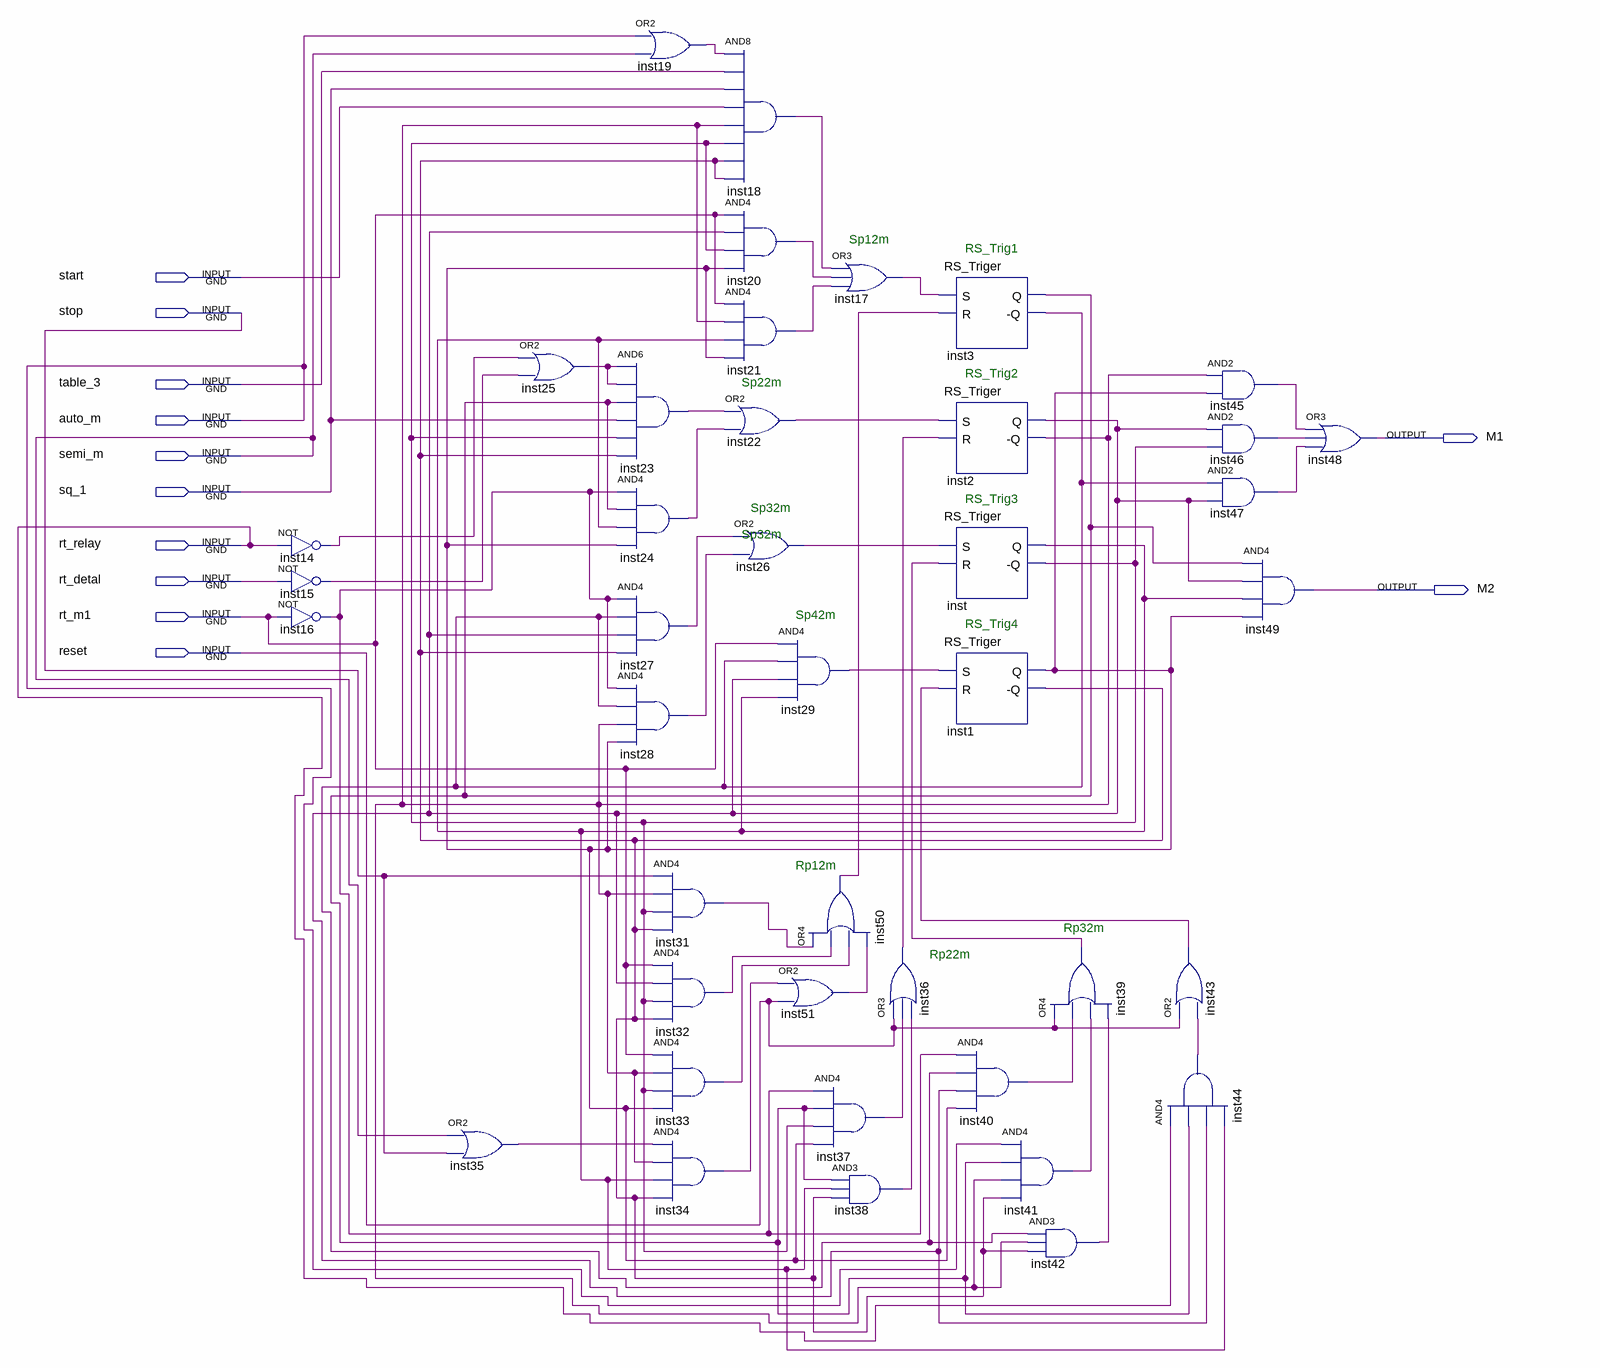
[diagram p0: schematic sheet]
// Quartus schematic auto_table_3.bdf as structural Verilog: 41 symbols, 12 pins
module auto_table_3 (
  input  start,
  input  stop,
  input  table_3,
  input  auto_m,
  input  semi_m,
  input  sq_1,
  input  rt_relay,
  input  rt_detal,
  input  rt_m1,
  input  reset,
  output M1,
  output M2
);

  wire inst1__q, inst1_q, inst2__q, inst2_q, inst3__q, inst3_q, inst14_out, inst15_out, inst16_out,
       inst17_out, inst18_out, inst19_out, inst20_out, inst21_out, inst22_out, inst23_out, inst24_out,
       inst25_out, inst26_out, inst27_out, inst28_out, inst29_out, inst31_out, inst32_out, inst33_out,
       inst34_out, inst35_out, inst36_out, inst37_out, inst38_out, inst39_out, inst40_out, inst41_out,
       inst42_out, inst43_out, inst44_out, inst45_out, inst46_out, inst47_out, inst50_out, inst51_out,
       inst__q, inst_q;

  not inst14 (inst14_out, rt_relay);
  not inst15 (inst15_out, rt_detal);
  not inst16 (inst16_out, rt_m1);
  or inst35 (inst35_out, semi_m, stop);
  or inst25 (inst25_out, inst14_out, inst15_out);
  or inst19 (inst19_out, auto_m, semi_m);
  and inst23 (inst23_out, inst25_out, inst25_out, inst3_q, sq_1, inst__q, inst1__q);
  and inst24 (inst24_out, inst16_out, inst3_q, inst_q, inst1_q);
  and inst27 (inst27_out, inst16_out, inst3__q, inst2_q, inst1__q);
  and inst28 (inst28_out, inst16_out, inst3__q, inst2__q, inst1_q);
  and inst31 (inst31_out, stop, inst2__q, inst__q, inst1__q);
  and inst32 (inst32_out, rt_m1, inst2_q, inst__q, inst1__q);
  and inst33 (inst33_out, rt_m1, inst2__q, inst__q, inst1_q);
  and inst34 (inst34_out, inst35_out, inst2__q, inst_q, inst1__q);
  and inst18 (inst18_out, inst19_out, table_3, sq_1, start, inst2__q, inst__q, inst1__q, inst1__q);
  and inst20 (inst20_out, rt_m1, inst2_q, inst__q, inst1_q);
  and inst21 (inst21_out, rt_m1, inst2__q, inst_q, inst1_q);
  or inst22 (inst22_out, inst23_out, inst24_out);
  or inst26 (inst26_out, inst27_out, inst28_out);
  and inst29 (inst29_out, rt_m1, inst3__q, inst2_q, inst_q);
  or inst50 (inst50_out, inst31_out, inst32_out, inst33_out, inst51_out);
  or inst51 (inst51_out, inst34_out, reset);
  and inst37 (inst37_out, inst16_out, inst3_q, inst__q, inst1_q);
  or inst17 (inst17_out, inst18_out, inst20_out, inst21_out);
  or inst36 (inst36_out, reset, inst37_out, inst38_out);
  and inst38 (inst38_out, inst3_q, inst_q, inst1__q);
  RS_Triger inst3 (.S(inst17_out), .R(inst50_out), .Q(inst3_q), .\-Q (inst3__q));
  RS_Triger inst2 (.S(inst22_out), .R(inst36_out), .Q(inst2_q), .\-Q (inst2__q));
  RS_Triger inst (.S(inst26_out), .R(inst39_out), .Q(inst_q), .\-Q (inst__q));
  RS_Triger inst1 (.S(inst29_out), .R(inst43_out), .Q(inst1_q), .\-Q (inst1__q));
  and inst40 (inst40_out, inst16_out, inst3__q, inst2_q, inst1_q);
  or inst39 (inst39_out, reset, inst40_out, inst41_out, inst42_out);
  and inst41 (inst41_out, auto_m, inst3_q, inst2__q, inst1__q);
  and inst42 (inst42_out, inst3__q, inst2__q, inst1__q);
  or inst43 (inst43_out, reset, inst44_out);
  and inst44 (inst44_out, rt_relay, inst3_q, inst2_q, inst_q);
  and inst45 (inst45_out, inst2__q, inst1_q);
  and inst46 (inst46_out, inst2_q, inst__q);
  and inst47 (inst47_out, inst3__q, inst2_q);
  and inst49 (M2, inst3_q, inst2_q, inst_q, inst1_q);
  or inst48 (M1, inst45_out, inst46_out, inst47_out);

  // Notes on the sheet:
  //   Sp12m
  //   RS_Trig1
  //   RS_Trig2
  //   Sp22m
  //   RS_Trig3
  //   Sp32m
  //   Sp32m
  //   Sp42m
  //   RS_Trig4
  //   Rp12m
  //   Rp32m
  //   Rp22m
endmodule
